# Altium schematic sheet Memory.SchDoc
size A4
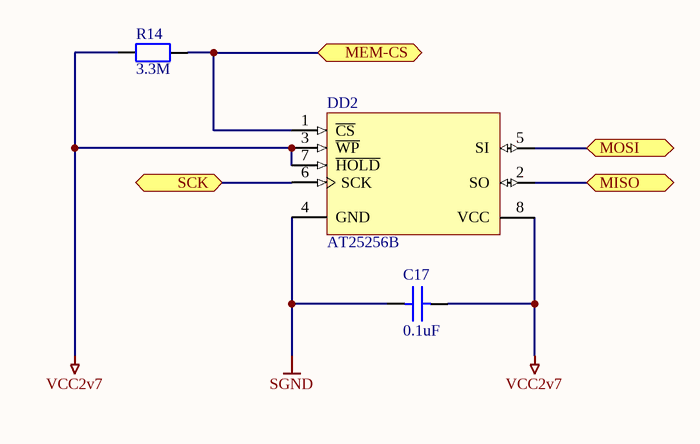
[diagram p0: Memory.SchDoc]

## Parts
C17  value 0.1uF  [C0805]  (hidden comment: C0.1uF-50V)
DD2  AT25256B  [8S12_UNIV]
R14  value 3.3M  [R0805]  (hidden comment: R3.3M-5%)

## Ports
MEM-CS, MISO, MOSI, SCK

## Nets
SGND: C17.1 DD2.4(GND)
VCC2v7: C17.2 DD2.3(~{WP}) DD2.7(~{HOLD}) DD2.8(VCC) R14.1
MEM-CS: DD2.1(~{CS}) R14.2 ; port MEM-CS
MISO: DD2.2(SO) ; port MISO
MOSI: DD2.5(SI) ; port MOSI
SCK: DD2.6(SCK) ; port SCK

## Library data of the parts
C17 = C0.1uF-50V: Type: Конденсатор керамический; Voltage: 50V; Name: C0.1uF-50V
DD2 = AT25256B: SPI Serial EEPROM 256K Memory; Name: AT25256B; Type: Память
R14 = R3.3M-5%: Precision: 5%; Type: Резистор; Name: R3.3M-5%